# Altium schematic sheet SIX-INPORT.SchDoc
size A3
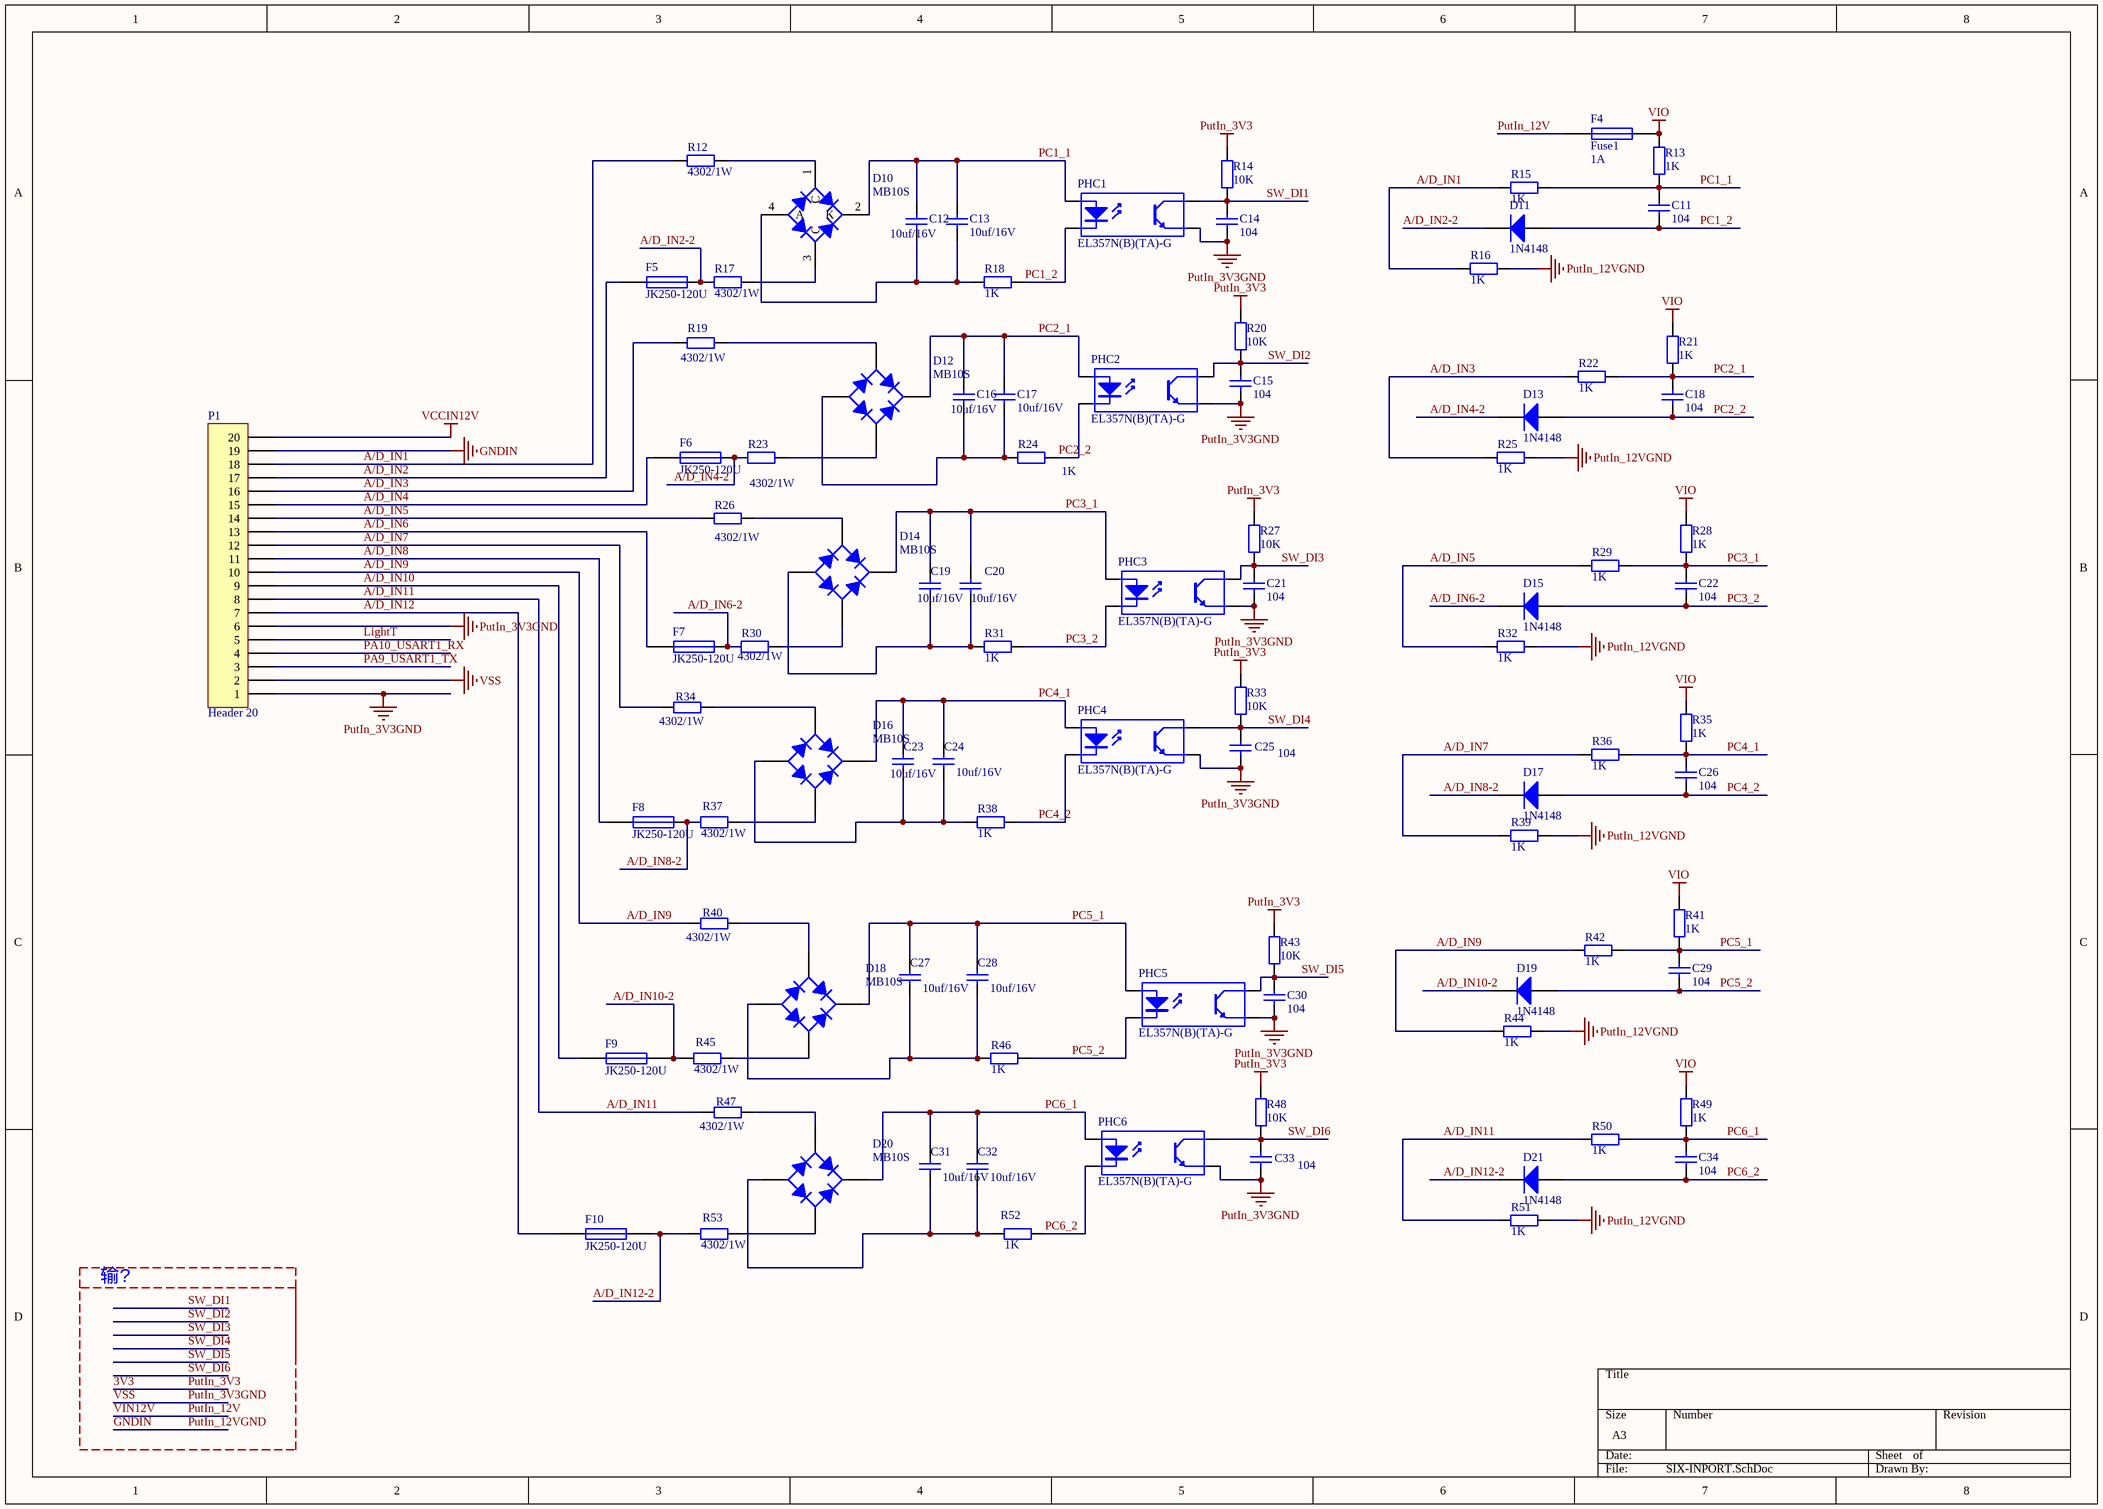
[diagram p0: SIX-INPORT.SchDoc]

## Parts
C11  104  [LC-1206_C]
C12  10uf/16V  [LC-0805_C]
C13  10uf/16V  [LC-0805_C]
C14  104  [LC-0603_C]
C15  104  [LC-0603_C]
C16  10uf/16V  [LC-0805_C]
C17  10uf/16V  [LC-0805_C]
C18  104  [LC-1206_C]
C19  10uf/16V  [LC-0805_C]
C20  10uf/16V  [LC-0805_C]
C21  104  [LC-0603_C]
C22  104  [LC-1206_C]
C23  10uf/16V  [LC-0805_C]
C24  10uf/16V  [LC-0805_C]
C25  104  [LC-0603_C]
C26  104  [LC-1206_C]
C27  10uf/16V  [LC-0805_C]
C28  10uf/16V  [LC-0805_C]
C29  104  [LC-1206_C]
C30  104  [LC-0603_C]
C31  10uf/16V  [LC-0805_C]
C32  10uf/16V  [LC-0805_C]
C33  104  [LC-0603_C]
C34  104  [LC-1206_C]
D10  MB10S  [LC-MBS]
D11  1N4148  [LC-LL-34]
D12  MB10S  [LC-MBS]
D13  1N4148  [LC-LL-34]
D14  MB10S  [LC-MBS]
D15  1N4148  [LC-LL-34]
D16  MB10S  [LC-MBS]
D17  1N4148  [LC-LL-34]
D18  MB10S  [LC-MBS]
D19  1N4148  [LC-LL-34]
D20  MB10S  [LC-MBS]
D21  1N4148  [LC-LL-34]
F4  Fuse1  value 1A  [LC-1206_R]
F5  JK250-120U  [ntc250v]
F6  JK250-120U  [ntc250v]
F7  JK250-120U  [ntc250v]
F8  JK250-120U  [ntc250v]
F9  JK250-120U  [ntc250v]
F10  JK250-120U  [ntc250v]
P1  Header 20  [HDR_5.0_20P]
PHC1  EL357N(B)(TA)-G  [LC-SOP-4_P2.54]
PHC2  EL357N(B)(TA)-G  [LC-SOP-4_P2.54]
PHC3  EL357N(B)(TA)-G  [LC-SOP-4_P2.54]
PHC4  EL357N(B)(TA)-G  [LC-SOP-4_P2.54]
PHC5  EL357N(B)(TA)-G  [LC-SOP-4_P2.54]
PHC6  EL357N(B)(TA)-G  [LC-SOP-4_P2.54]
R12  4302/1W  [LC-2512_R]
R13  value 1K  [LC-1206_R]  (hidden comment: Res1)
R14  10K  [LC-0603_R]
R15  value 1K  [LC-1206_R]  (hidden comment: Res1)
R16  value 1K  [LC-1206_R]  (hidden comment: Res1)
R17  4302/1W  [LC-2512_R]
R18  1K  [LC-0603_R]
R19  4302/1W  [LC-2512_R]
R20  10K  [LC-0603_R]
R21  value 1K  [LC-1206_R]  (hidden comment: Res1)
R22  value 1K  [LC-1206_R]  (hidden comment: Res1)
R23  4302/1W  [LC-2512_R]
R24  1K  [LC-0603_R]
R25  value 1K  [LC-1206_R]  (hidden comment: Res1)
R26  4302/1W  [LC-2512_R]
R27  10K  [LC-0603_R]
R28  value 1K  [LC-1206_R]  (hidden comment: Res1)
R29  value 1K  [LC-1206_R]  (hidden comment: Res1)
R30  4302/1W  [LC-2512_R]
R31  1K  [LC-0603_R]
R32  value 1K  [LC-1206_R]  (hidden comment: Res1)
R33  10K  [LC-0603_R]
R34  4302/1W  [LC-2512_R]
R35  value 1K  [LC-1206_R]  (hidden comment: Res1)
R36  value 1K  [LC-1206_R]  (hidden comment: Res1)
R37  4302/1W  [LC-2512_R]
R38  1K  [LC-0603_R]
R39  value 1K  [LC-1206_R]  (hidden comment: Res1)
R40  4302/1W  [LC-2512_R]
R41  value 1K  [LC-1206_R]  (hidden comment: Res1)
R42  value 1K  [LC-1206_R]  (hidden comment: Res1)
R43  10K  [LC-0603_R]
R44  value 1K  [LC-1206_R]  (hidden comment: Res1)
R45  4302/1W  [LC-2512_R]
R46  1K  [LC-0603_R]
R47  4302/1W  [LC-2512_R]
R48  10K  [LC-0603_R]
R49  value 1K  [LC-1206_R]  (hidden comment: Res1)
R50  value 1K  [LC-1206_R]  (hidden comment: Res1)
R51  value 1K  [LC-1206_R]  (hidden comment: Res1)
R52  1K  [LC-0603_R]
R53  4302/1W  [LC-2512_R]

## Nets
3V3: R14.2 R20.2 R27.2 R33.2 R43.2 R48.2  [also labelled PutIn_3V3]
GNDIN: P1.19 R16.1 R25.1 R32.1 R39.1 R44.1 R51.1  [also labelled PutIn_12VGND]
PutIn_3V3GND: C14.2 C15.2 C21.2 C25.2 C30.2 C33.2 P1.1 P1.2 P1.6 PHC1.3(E) PHC2.3(E) PHC3.3(E) PHC4.3(E) PHC5.3(E) PHC6.3(E)  [also labelled VSS]
VCCIN12V: P1.20
VIO: F4.2 R13.2 R21.1 R28.1 R35.1 R41.1 R49.1
A/D_IN1: P1.18 R12.1 R15.2 R16.2
A/D_IN2: F5.1 P1.17
A/D_IN2-2: D11.2(K) F5.2 R17.1
A/D_IN3: P1.16 R19.1 R22.2 R25.2
A/D_IN4: F6.1 P1.15
A/D_IN4-2: D13.2(K) F6.2 R23.1
A/D_IN5: P1.14 R26.1 R29.2 R32.2
A/D_IN6: F7.1 P1.13
A/D_IN6-2: D15.2(K) F7.2 R30.1
A/D_IN7: P1.12 R34.1 R36.2 R39.2
A/D_IN8: F8.1 P1.11
A/D_IN8-2: D17.2(K) F8.2 R37.1
A/D_IN9: P1.10 R40.1 R42.2 R44.2
A/D_IN10: F9.1 P1.9
A/D_IN10-2: D19.2(K) F9.2 R45.1
A/D_IN11: P1.8 R47.1 R50.2 R51.2
A/D_IN12: F10.1 P1.7
A/D_IN12-2: D21.2(K) F10.2 R53.1
LightT: P1.5
PA9_USART1_TX: P1.3
PA10_USART1_RX: P1.4
PC1_1: C11.1 C12.2 C13.2 D10.2(K) PHC1.1(A) R13.1 R15.1
PC1_2: C11.2 D11.1(A) PHC1.2(K) R18.1
PC2_1: C16.2 C17.2 C18.1 D12.2(K) PHC2.1(A) R21.2 R22.1
PC2_2: C18.2 D13.1(A) PHC2.2(K) R24.1
PC3_1: C19.2 C20.2 C22.1 D14.2(K) PHC3.1(A) R28.2 R29.1
PC3_2: C22.2 D15.1(A) PHC3.2(K) R31.1
PC4_1: C23.2 C24.2 C26.1 D16.2(K) PHC4.1(A) R35.2 R36.1
PC4_2: C26.2 D17.1(A) PHC4.2(K) R38.1
PC5_1: C27.2 C28.2 C29.1 D18.2(K) PHC5.1(A) R41.2 R42.1
PC5_2: C29.2 D19.1(A) PHC5.2(K) R46.1
PC6_1: C31.2 C32.2 C34.1 D20.2(K) PHC6.1(A) R49.2 R50.1
PC6_2: C34.2 D21.1(A) PHC6.2(K) R52.1
PutIn_12V: F4.1  [also labelled VIN12V]
SW_DI1: C14.1 PHC1.4(C) R14.1
SW_DI2: C15.1 PHC2.4(C) R20.1
SW_DI3: C21.1 PHC3.4(C) R27.1
SW_DI4: C25.1 PHC4.4(C) R33.1
SW_DI5: C30.1 PHC5.4(C) R43.1
SW_DI6: C33.1 PHC6.4(C) R48.1
NetC12_1: C12.1 C13.1 D10.4(A) R18.2
NetC16_1: C16.1 C17.1 D12.4(A) R24.2
NetC19_1: C19.1 C20.1 D14.4(A) R31.2
NetC23_1: C23.1 C24.1 D16.4(A) R38.2
NetC27_1: C27.1 C28.1 D18.4(A) R46.2
NetC31_1: C31.1 C32.1 D20.4(A) R52.2
NetD10_1: D10.1(C) R12.2
NetD10_3: D10.3(C) R17.2
NetD12_1: D12.1(C) R19.2
NetD12_3: D12.3(C) R23.2
NetD14_1: D14.1(C) R26.2
NetD14_3: D14.3(C) R30.2
NetD16_1: D16.1(C) R34.2
NetD16_3: D16.3(C) R37.2
NetD18_1: D18.1(C) R40.2
NetD18_3: D18.3(C) R45.2
NetD20_1: D20.1(C) R47.2
NetD20_3: D20.3(C) R53.2

## Notes on the sheet
- 输?

## Library data of the parts
C11 C18 C22 C26 C29 C34 = Cap: Capacitor; Value: 100nF; Published: 8-Jun-2000; Revision: July-2002: Re-released for DXP Platform.; Publisher: Altium Limited
C12-C17 C19-C21 C23-C25 C27 C28 C30-C33 = Cap: Capacitor; Value: 100pF; Published: 8-Jun-2000; LatestRevisionDate: 17-Jul-2002; LatestRevisionNote: Re-released for DXP Platform.; PackageReference: RAD-0.3; Publisher: Altium Limited; PackageDescription: Radial Cap, Thru-Hole; 2 Leads; 0.3 in Pin Spacing
D10 D12 D14 D16 D18 D20 = MBS: 整流桥; ComponentLink1Description: 供应商链接; ComponentLink1URL: http://www.szlcsc.com/product/details_2865.html; Package: MBS; Supplier: LC; SuppliersPartNumber: C2488
D11 D13 D15 D17 D19 D21 = Diode: Default Diode; Published: 8-Jun-2000; LatestRevisionDate: 17-Jul-2002; LatestRevisionNote: Re-released for DXP Platform.; PackageDocument: Sep-1996; PackageReference: SMC; Publisher: Altium Limited; Code_JEDEC: DO-214-AB
F4 = F: 保险丝
F5-F10 = Fuse1: 保险丝; Value: 1A
P1 = Header 20: Header, 20-Pin; LatestRevisionDate: 17-Jul-2002; LatestRevisionNote: Re-released for DXP Platform.; Publisher: Altium Limited
PHC1-PHC6 = EL357N: 贴片光耦; ComponentLink1Description: 供应商链接; ComponentLink1URL: http://www.szlcsc.com/product/details_7114.html; Package: SOP-4_P2.54; Supplier: LC; SuppliersPartNumber: C6649
R12 R14 R17 R19 R20 R23 R26 R27 R30 R33 R34 R37 R40 R43 R45 R47 R48 R53 = Res2: Resistor; Value: 1K; Published: 8-Jun-2000; LatestRevisionDate: 17-Jul-2002; LatestRevisionNote: Re-released for DXP Platform.; PackageReference: AXIAL-0.4; Publisher: Altium Limited; PackageDescription: Axial Device, Thru-Hole; 2 Leads; 0.4 in Pin Spacing
R13 R15 R16 R21 R22 R25 R28 R29 R32 R35 R36 R39 R41 R42 R44 R49-R51 = R: 贴片电阻; Published: 8-Jun-2000; LatestRevisionDate: 17-Jul-2002; LatestRevisionNote: Re-released for DXP Platform.; PackageReference: AXIAL-0.4; Publisher: Altium Limited
R18 R24 R31 R38 R46 R52 = Res2: Resistor; Published: 8-Jun-2000; LatestRevisionDate: 17-Jul-2002; LatestRevisionNote: Re-released for DXP Platform.; PackageReference: AXIAL-0.4; Publisher: Altium Limited; PackageDescription: Axial Device, Thru-Hole; 2 Leads; 0.4 in Pin Spacing; Value: 1K